# EAGLE design BPW5020-Audio (EAGLE 5.06)
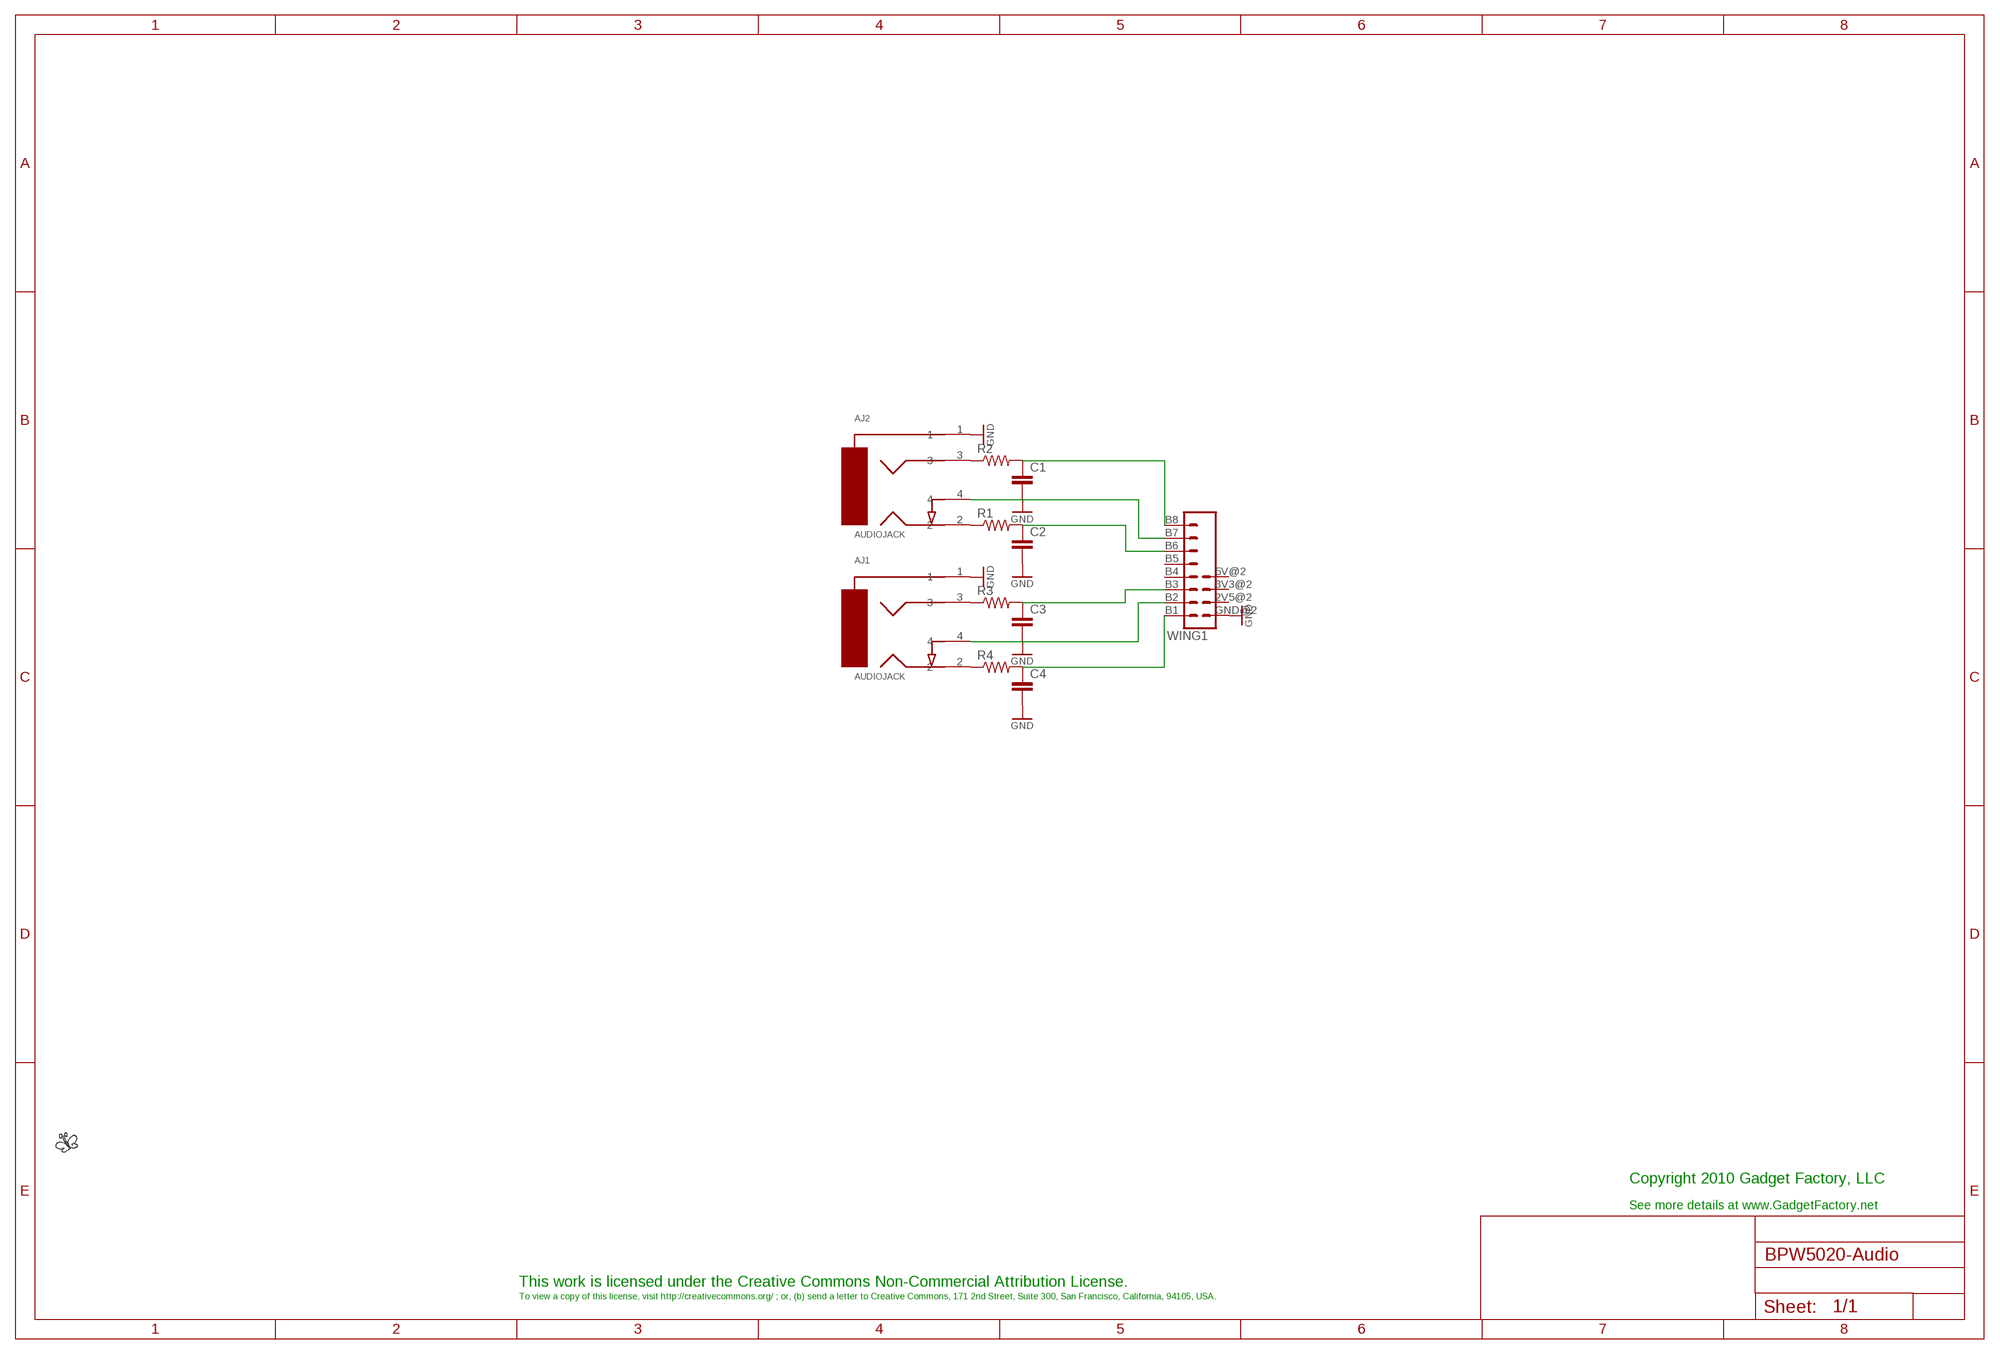
[diagram p0: schematic, sheet 1]

## Parts
AJ1  AUDIOJACK  [AUDJCK]
AJ2  AUDIOJACK  [AUDJCK]
C1  C-EU025-025X050  [C025-025X050]
C2  C-EU025-025X050  [C025-025X050]
C3  C-EU025-025X050  [C025-025X050]
C4  C-EU025-025X050  [C025-025X050]
LOGO2  BUTTERFLY_LOGO  [BUTTERFLY_LOGO]
R1  R-US_0204/7  [0204/7]
R2  R-US_0204/7  [0204/7]
R3  R-US_0204/7  [0204/7]
R4  R-US_0204/7  [0204/7]
WING1  WING_8BIT  [WINGSIDE_8BIT]

## Nets
GND: AJ1.1 AJ2.1 C1.2 C2.2 C3.2 C4.2 WING1.GND@2(GND)
N$1: AJ2.2 R1.1
N$2: AJ2.3 R2.1
N$3: AJ1.3 R3.1
N$4: AJ1.2 R4.1
N$5: C1.1 R2.2 WING1.B8
N$6: C2.1 R1.2 WING1.B6
N$7: C3.1 R3.2 WING1.B3
N$8: C4.1 R4.2 WING1.B1
N$9: AJ2.4 WING1.B7
N$10: AJ1.4 WING1.B2
Unconnected: WING1.2V5@2(2V5) WING1.3V3@2(3V3) WING1.5V@2(5V) WING1.B4 WING1.B5

## Notes on the sheet
- Copyright 2010 Gadget Factory, LLC
- See more details at www.GadgetFactory.net
- This work is licensed under the Creative Commons Non-Commercial Attribution License.
- To view a copy of this license, visit http://creativecommons.org/ ; or, (b) send a letter to Creative Commons, 171 2nd Street, Suite 300, San Francisco, California, 94105, USA.

## Library data of the parts
AJ1 AJ2 = GadgetFactory:AUDIOJACK
C1-C4 = resistor:C-EU: CAPACITOR, European symbol
LOGO2 = GadgetFactory_Pub:BUTTERFLY_LOGO
R1-R4 = resistor:R-US_: RESISTOR, American symbol
WING1 = GadgetFactory_Pub:WING_8BIT

## Board
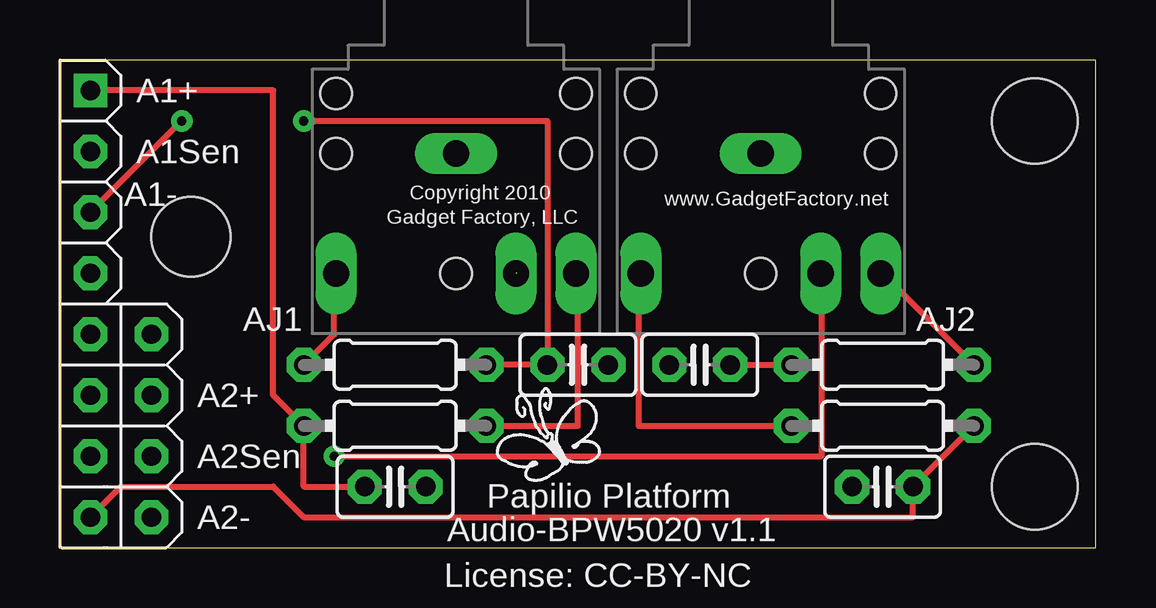
[diagram p1: board, top side]
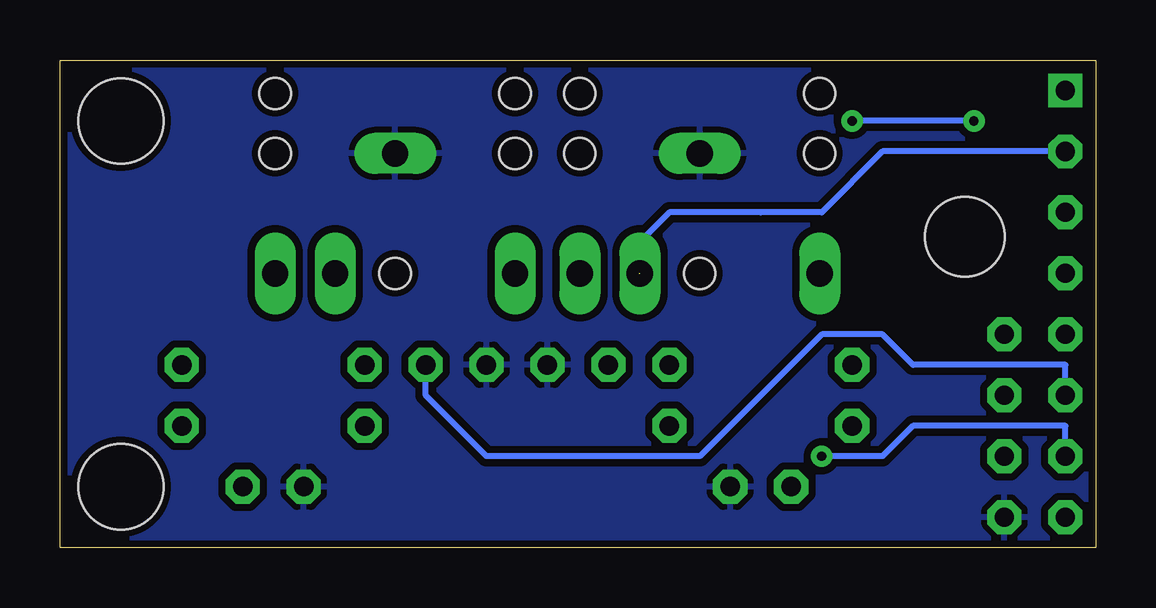
[diagram p2: board, bottom side, seen from below]

Size 43.18 x 20.32 mm. Coordinates in mm from the lower left corner, seen from the top.
Outline: 0,0 43.18,0 43.18,20.32 0,20.31 0,0
Copper layers (1*16): Top 0.035mm / dielectric 1.5mm / Bottom 0.035mm
Design rules "SparkFun_Derived_GoldePheonix_10mil": minimum track width 10mil, minimum drill 15mil, track to track 8mil, track to pad 8mil, pad to pad 8mil, via to via 8mil, smd to smd 8mil, copper to edge 10mil, drill to drill 8mil, minimum pad ring 12mil, minimum via ring 10mil, stop-mask expansion 4mil, vias tented up to drill 18mil, thermal gap 10mil
Holes 3.56 mm at 40.64,2.54 40.64,17.78

### Footprints (pad centres in the part's own frame; a part is rotated, then mirrored left to right if it is on the bottom)
AUDJCK = drill 1.1 long: 1 -5,0; 2 0,5; 3 0,-5; 4 0,2.5 | hole 1.3: -5,5; -5,-5; -7.5,5; -7.5,-5; 0,0
C025-025X050 = drill 0.813 octagon: 1 -1.27,0; 2 1.27,0
0204/7 = drill 0.813 octagon: 1 -3.81,0; 2 3.81,0
WINGSIDE_8BIT = drill 0.8 octagon: 2V5@2 16.51,3.81; 3V3@2 13.97,3.81; 5V@2 11.43,3.81; B2 3.81,1.27; B3 6.35,1.27; B4 8.89,1.27; B5 11.43,1.27; B6 13.97,1.27; B7 16.51,1.27; B8 19.05,1.27; GND@2 19.05,3.81 | drill 0.8 square: B1 1.27,1.27 | hole 3.302: 7.366,5.461

### Placement (x,y rotation side)
AJ1  16.51,11.43 270 top
AJ2  29.21,11.43 270 top
C1  34.29,2.54 180 top
C2  26.67,7.62 180 top
C3  21.59,7.62 0 top
C4  13.97,2.54 0 top
LOGO2  20.45,4.19 0 top
R1  34.29,7.62 180 top
R2  34.29,5.08 0 top
R3  13.97,7.62 0 top
R4  13.97,5.08 180 top
WING1  0,20.32 270 top

### Tracks (layer width: path | path; a pad name or v marks a point on that pad's centre or on a via)
GND
  pour Bottom (isolate 0.305): 0,20.32 43.18,20.32 43.18,0 0,0
N$1
  Top 0.254: R1.1 34.29,11.43 AJ2.2
N$2
  Top 0.254: R2.1 24.13,5.08 24.13,11.43 AJ2.3
N$3
  Top 0.254: R3.1 11.43,8.89 11.43,11.43 AJ1.3
N$4
  Top 0.254: R4.1 21.59,5.08 21.59,11.43 AJ1.2
N$5
  Top 0.254: WING1.B8 2.54,2.54 8.89,2.54 10.16,1.27 35.56,1.27 C1.1 R2.2
N$6
  Top 0.254: C2.1 R1.2
  Bottom 0.254: WING1.B6 1.27,7.62 7.62,7.62 8.89,8.89 11.43,8.89 16.51,3.81 25.4,3.81 27.94,6.35 C2.1
N$7  (via drill 0.38)
  Top 0.254: WING1.B3 v5.08,17.78 | v10.16,17.78 20.32,17.78 C3.1 R3.2
  Bottom 0.254: v5.08,17.78 v10.16,17.78
N$8
  Top 0.254: WING1.B1 8.89,19.05 8.89,6.35 R4.2 10.16,2.54 C4.1
N$9  (via drill 0.38)
  Top 0.254: v11.43,3.81 31.75,3.81 31.75,11.43 AJ2.4
  Bottom 0.254: WING1.B7 1.27,5.08 7.62,5.08 8.89,3.81 v11.43,3.81
N$10  (1 unrouted)
  Bottom 0.254: WING1.B2 8.89,16.51 11.43,13.97 13.97,13.97 17.78,13.97 19.05,12.7 19.05,11.43

### Text on the board
tPlace: A1+ | A1Sen | Copyright 2010 | www.GadgetFactory.net | A1- | Gadget Factory, LLC | AJ1 | AJ2 | A2+ | A2Sen | Papilio Platform | A2- | Audio-BPW5020 v1.1 | License: CC-BY-NC